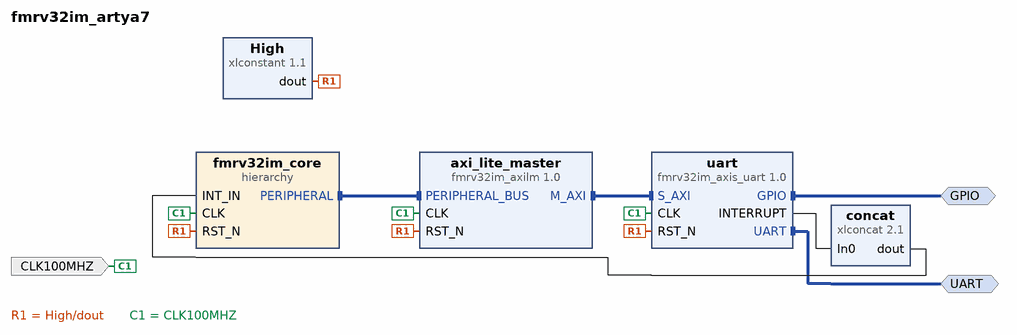
[diagram p0: block diagram of the top level]
# Vivado block design fmrv32im_artya7, xc7a35ticsg324-1L, Vivado 2017.2
create_bd_design fmrv32im_artya7

create_bd_intf_port -mode Master -vlnv user.org:user:GPIO_rtl:1.0 GPIO
create_bd_intf_port -mode Master -vlnv user.org:user:UART_rtl:1.0 UART
create_bd_port -dir I -type clk CLK100MHZ

create_bd_cell -type ip -vlnv xilinx.com:ip:xlconcat:2.1 concat
set_property -dict {CONFIG.NUM_PORTS 1} [get_bd_cells concat]
create_bd_cell -type ip -vlnv xilinx.com:ip:xlconstant:1.1 High
create_bd_cell -type hier fmrv32im_core
create_bd_cell -type ip -vlnv user.org:user:fmrv32im_axilm:1.0 axi_lite_master
create_bd_cell -type ip -vlnv user.org:user:fmrv32im_axis_uart:1.0 uart

# ---- hierarchy /fmrv32im_core ----
current_bd_instance /fmrv32im_core
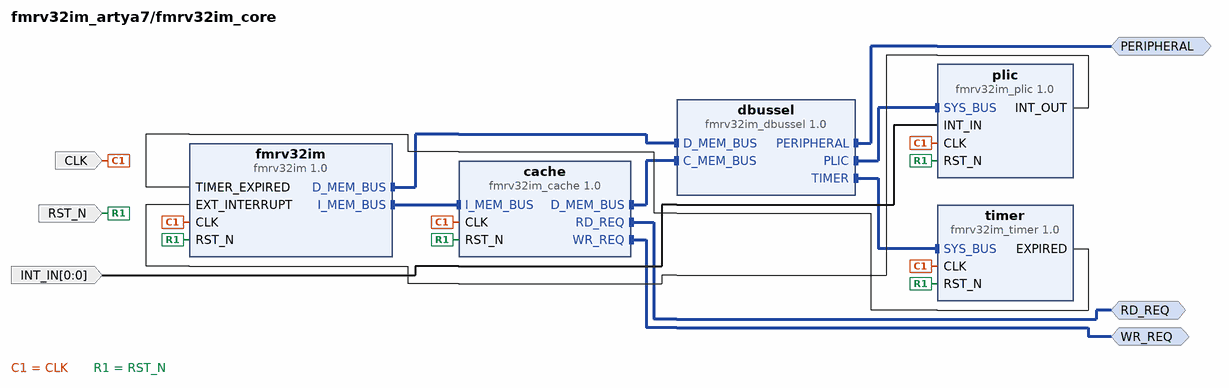
[diagram p1: block diagram inside /fmrv32im_core]
create_bd_intf_pin -mode Master -vlnv user.org:user:REQ_BUS_rtl:1.0 RD_REQ
create_bd_intf_pin -mode Master -vlnv user.org:user:REQ_BUS_rtl:1.0 WR_REQ
create_bd_intf_pin -mode Master -vlnv user.org:user:PERIPHERAL_BUS_rtl:1.0 PERIPHERAL
create_bd_pin -dir I -type clk CLK
create_bd_pin -dir I -type rst RST_N
create_bd_pin -dir I -from 0 -to 0 INT_IN

create_bd_cell -type ip -vlnv user.org:user:fmrv32im_dbussel:1.0 dbussel
create_bd_cell -type ip -vlnv user.org:user:fmrv32im_plic:1.0 plic
create_bd_cell -type ip -vlnv user.org:user:fmrv32im_timer:1.0 timer
create_bd_cell -type ip -vlnv user.org:user:fmrv32im_cache:1.0 cache
set_property -dict {CONFIG.MEM_FILE /home/hidemi/workspace/FPGAMAG18/FPGA/romdata/artya7.hex CONFIG.OSRAM 0} [get_bd_cells cache]
create_bd_cell -type ip -vlnv user.org:user:fmrv32im:1.0 fmrv32im
set_property -dict {CONFIG.MADD33_ADDON 1} [get_bd_cells fmrv32im]

# ---- connections ----

current_bd_instance /fmrv32im_core
connect_bd_intf_net [get_bd_intf_pins fmrv32im/D_MEM_BUS] [get_bd_intf_pins dbussel/D_MEM_BUS]
connect_bd_intf_net [get_bd_intf_pins fmrv32im/I_MEM_BUS] [get_bd_intf_pins cache/I_MEM_BUS]
connect_bd_intf_net -intf_net dbussel_upgraded_ipi_C_MEM_BUS [get_bd_intf_pins cache/D_MEM_BUS] [get_bd_intf_pins dbussel/C_MEM_BUS]
connect_bd_intf_net -intf_net dbussel_upgraded_ipi_PLIC [get_bd_intf_pins dbussel/PLIC] [get_bd_intf_pins plic/SYS_BUS]
connect_bd_intf_net -intf_net dbussel_upgraded_ipi_TIMER [get_bd_intf_pins dbussel/TIMER] [get_bd_intf_pins timer/SYS_BUS]
connect_bd_intf_net [get_bd_intf_pins RD_REQ] [get_bd_intf_pins cache/RD_REQ]
connect_bd_intf_net [get_bd_intf_pins WR_REQ] [get_bd_intf_pins cache/WR_REQ]
connect_bd_intf_net [get_bd_intf_pins PERIPHERAL] [get_bd_intf_pins dbussel/PERIPHERAL]
connect_bd_net [get_bd_pins timer/EXPIRED] [get_bd_pins fmrv32im/TIMER_EXPIRED]
connect_bd_net [get_bd_pins CLK] [get_bd_pins plic/CLK] [get_bd_pins timer/CLK] [get_bd_pins cache/CLK] [get_bd_pins fmrv32im/CLK]
connect_bd_net [get_bd_pins RST_N] [get_bd_pins plic/RST_N] [get_bd_pins timer/RST_N] [get_bd_pins cache/RST_N] [get_bd_pins fmrv32im/RST_N]
connect_bd_net -net fmrv32im_plic_0_INT_OUT [get_bd_pins plic/INT_OUT] [get_bd_pins fmrv32im/EXT_INTERRUPT]
connect_bd_net [get_bd_pins INT_IN] [get_bd_pins plic/INT_IN]

current_bd_instance /
connect_bd_intf_net -intf_net axilm_M_AXI [get_bd_intf_pins axi_lite_master/M_AXI] [get_bd_intf_pins uart/S_AXI]
connect_bd_intf_net [get_bd_intf_pins axi_lite_master/PERIPHERAL_BUS] [get_bd_intf_pins fmrv32im_core/PERIPHERAL]
connect_bd_intf_net -intf_net fmrv32im_axis_uart_0_GPIO [get_bd_intf_ports GPIO] [get_bd_intf_pins uart/GPIO]
connect_bd_intf_net -intf_net fmrv32im_axis_uart_0_UART [get_bd_intf_ports UART] [get_bd_intf_pins uart/UART]
connect_bd_net [get_bd_pins High/dout] [get_bd_pins axi_lite_master/RST_N] [get_bd_pins uart/RST_N] [get_bd_pins fmrv32im_core/RST_N]
connect_bd_net -net CLK_1 [get_bd_ports CLK100MHZ] [get_bd_pins axi_lite_master/CLK] [get_bd_pins uart/CLK] [get_bd_pins fmrv32im_core/CLK]
connect_bd_net -net fmrv32im_axis_uart_0_INTERRUPT [get_bd_pins uart/INTERRUPT] [get_bd_pins concat/In0]
connect_bd_net [get_bd_pins concat/dout] [get_bd_pins fmrv32im_core/INT_IN]

# ---- address map ----
assign_bd_address -offset 0x80000000 -range 64K -target_address_space [get_bd_addr_spaces axi_lite_master/M_AXI] [get_bd_addr_segs uart/S_AXI/reg0]

validate_bd_design
save_bd_design
